# Altium schematic sheet LD1117.SchDoc
size A; Author: Erick Miranda Quinde; DrawnBy: Erick Miranda Quinde; DocumentNumber: 0000-0000-0005; Revision: V2.0; SheetNumber: 5; SheetTotal: 5
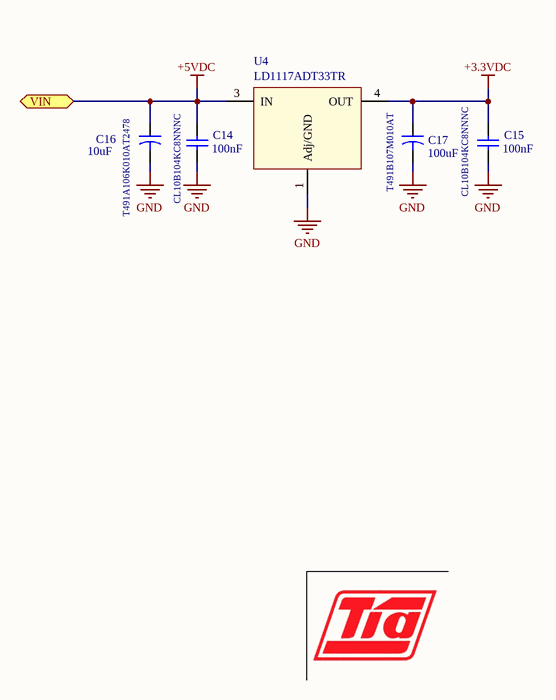
[diagram p0: LD1117.SchDoc]

## Parts
C14  CL10B104KC8NNNC  value 100nF  [C0603C104K5RACTU]
C15  CL10B104KC8NNNC  value 100nF  [C0603C104K5RACTU]
C16  T491A106K010AT2478  value 10uF  [3216 Case-A]
C17  T491B107M010AT  value 100uF  [TAJB107M006RNJ]
U4  LD1117ADT33TR  [TO252]

## Ports
VIN (bidir)

## Nets
+3.3VDC: C15.2 C17.1 U4.4(OUT)
+5VDC: C14.2 C16.1 U4.3(IN) ; port VIN
GND: C14.1 C15.1 C16.2 C17.2 U4.1(Adj/GND)

## Library data of the parts
C14 C15 = Cap 100nF (0603): PART_NUM: CL10B104KC8NNNC; Price: $0.02; Link Store: https://lcsc.com/product-detail/Multilayer-Ceramic-Capacitors-MLCC-SMD-SMT_SAMSUNG_CL10B104KC8NNNC_100nF-104-10-100V_C15725.html; LCSC Part: C15725
C16 = T491A106M006AT: CAP TANT 10UF 6.3V 20% 1206; Price: $0.11; Link Store: https://lcsc.com/product-detail/Tantalum-Capacitors_KEMET_T491A106K010AT_10uF-106-10-10V_C110052.html; LCSC Part: C110052
C17 = Cap 10uF (C3216): Capacitor; Price: $0.29; Link Store: https://lcsc.com/product-detail/Tantalum-Capacitors_KEMET-T491B107M010AT_C90975.html; LCSC Part: C90975
U4 = LM1117DT: 800mA Low-Dropout Linear Regulator; Manufacturer: National Semiconductor; Datasheet: http://www.national.com/ds/LM/LM1117.pdf; Price: $0.96; Link Store: https://lcsc.com/product-detail/Low-Dropout-Regulators-LDO_STMicroelectronics-LD1117ADT33TR_C157401.html; LCSC Part: C157401